# Altium schematic sheet Connectors.SchDoc
size Tabloid; Organization: Altium Limited; Address1: L3, 12a Rodborough Rd; Address2: Frenchs Forest; Address3: NSW; Address4: Australia 2086
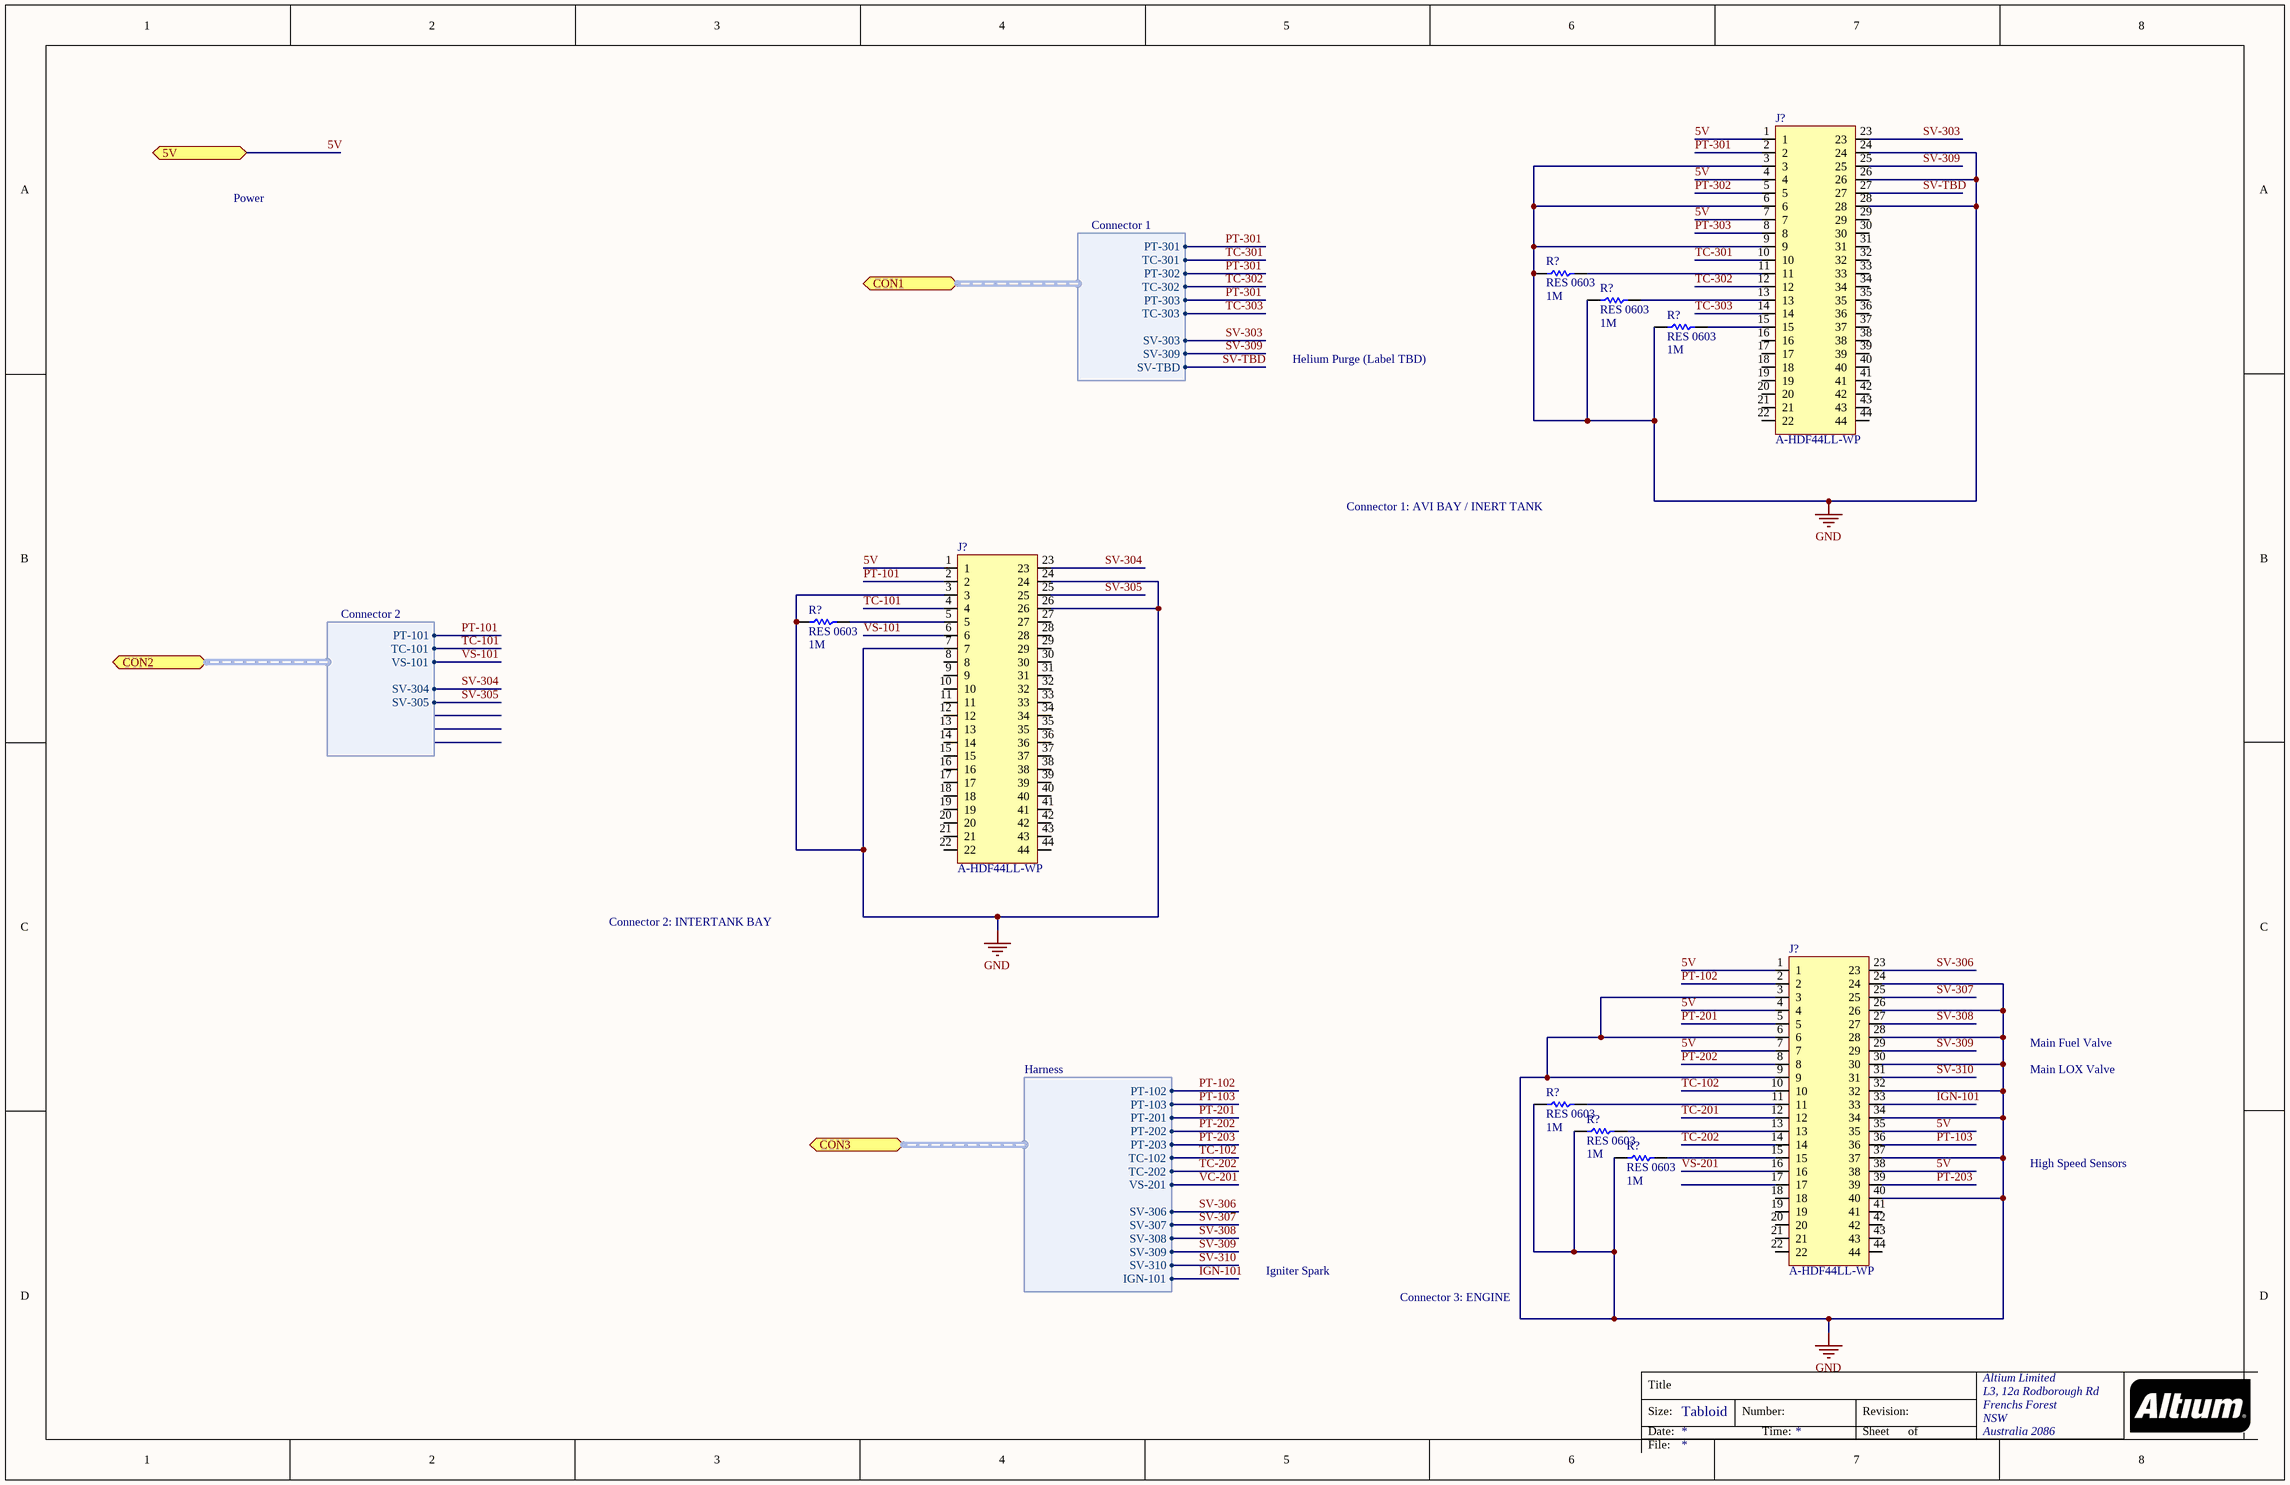
[diagram p0: Connectors.SchDoc]

## Parts
(Parts that share a designator on the sheet are numbered #1, #2 ... from top to bottom, then left to right.)
J?#1  A-HDF44LL-WP  [DSUB-44pin]
J?#2  A-HDF44LL-WP  [DSUB-44pin]
J?#3  A-HDF44LL-WP  [DSUB-44pin]
R?#1  RES 0603  Value (Ohms): 1M  [RES 0603]
R?#2  RES 0603  Value (Ohms): 1M  [RES 0603]
R?#3  RES 0603  Value (Ohms): 1M  [RES 0603]
R?#4  RES 0603  Value (Ohms): 1M  [RES 0603]
R?#5  RES 0603  Value (Ohms): 1M  [RES 0603]
R?#6  RES 0603  Value (Ohms): 1M  [RES 0603]
R?#7  RES 0603  Value (Ohms): 1M  [RES 0603]

## Ports
5V, CON1 (harness Connector 1), CON2 (harness Connector 2), CON3 (harness Harness)

## Harnesses
Connector 1: PT-301, SV-303, SV-TBD, SV-309, TC-301, TC-302, PT-302, TC-303, PT-303
Connector 2: PT-101, TC-101, SV-305, VS-101, SV-304
Harness: PT-102, PT-103, PT-201, PT-202, PT-203, TC-102, TC-202, VS-201, SV-307, SV-308, SV-306, SV-309, SV-310, IGN-101

## Nets
GND: J?#1.3 J?#1.6 J?#1.9 J?#1.24 J?#1.26 J?#1.28 J?#2.3 J?#2.7 J?#2.24 J?#2.26 J?#3.3 J?#3.6 J?#3.9 J?#3.24 J?#3.26 J?#3.28 J?#3.30 J?#3.32 J?#3.34 J?#3.37 J?#3.40 R?#1.1 R?#2.1 R?#3.1 R?#4.1 R?#5.1 R?#6.1 R?#7.1
5V: J?#1.1 J?#1.4 J?#1.7 J?#2.1 J?#3.1 J?#3.4 J?#3.7 J?#3.35 J?#3.38 ; port 5V
IGN-101: J?#3.33 ; port CON3.IGN-101
PT-101: J?#2.2 ; port CON2.PT-101
PT-102: J?#3.2 ; port CON3.PT-102
PT-103: J?#3.36 ; port CON3.PT-103
PT-201: J?#3.5 ; port CON3.PT-201
PT-202: J?#3.8 ; port CON3.PT-202
PT-203: J?#3.39 ; port CON3.PT-203
PT-301: J?#1.2 ; port CON1.PT-301, port CON1.PT-302, port CON1.PT-303
PT-302: J?#1.5
PT-303: J?#1.8
SV-303: J?#1.23 ; port CON1.SV-303
SV-304: J?#2.23 ; port CON2.SV-304
SV-305: J?#2.25 ; port CON2.SV-305
SV-306: J?#3.23 ; port CON3.SV-306
SV-307: J?#3.25 ; port CON3.SV-307
SV-308: J?#3.27 ; port CON3.SV-308
SV-309: J?#1.25 J?#3.29 ; port CON1.SV-309, port CON3.SV-309
SV-310: J?#3.31 ; port CON3.SV-310
SV-TBD: J?#1.27 ; port CON1.SV-TBD
TC-101: J?#2.4 ; port CON2.TC-101
TC-102: J?#3.10 ; port CON3.TC-102
TC-201: J?#3.12
TC-202: J?#3.14 ; port CON3.TC-202
TC-301: J?#1.10 ; port CON1.TC-301
TC-302: J?#1.12 ; port CON1.TC-302
TC-303: J?#1.14 ; port CON1.TC-303
VC-201: port CON3.VS-201
VS-101: J?#2.6 ; port CON2.VS-101
VS-201: J?#3.16
NetJ?#1_11: J?#1.11 R?#1.2
NetJ?#1_13: J?#1.13 R?#2.2
NetJ?#1_15: J?#1.15 R?#3.2
NetJ?#2_5: J?#2.5 R?#4.2
NetJ?#3_11: J?#3.11 R?#5.2
NetJ?#3_13: J?#3.13 R?#6.2
NetJ?#3_15: J?#3.15 R?#7.2

Not connected (* = marked no-connect by the designer): J?#1 16 17 18 19 20 21 22 29 30 31 32 33 34 35 36 37 38 39 40 41 42 43 44; J?#2 8 9 10 11 12 13 14 15 16 17 18 19 20 21 22 27 28 29 30 31 32 33 34 35 36 37 38 39 40 41 42 43 44; J?#3 17 18 19 20 21 22 41 42 43 44

## Notes on the sheet
- Power
- Helium Purge (Label TBD)
- Connector 1: AVI BAY / INERT TANK
- Connector 2: INTERTANK BAY
- Main Fuel Valve
- Main LOX Valve
- High Speed Sensors
- Igniter Spark
- Connector 3: ENGINE
- Title
- Size:
- Date:
- Tabloid
- Number:
- Time:
- Revision:
- Sheet
- of
- File:

## Library data of the parts
J?#1-J?#3 = A-HDF44LL-WP: Connector
R?#1-R?#7 = RES 0603: PartNumber: *; Tolerance: *